# Altium schematic sheet 主板-09099.SCHDOC
size A4
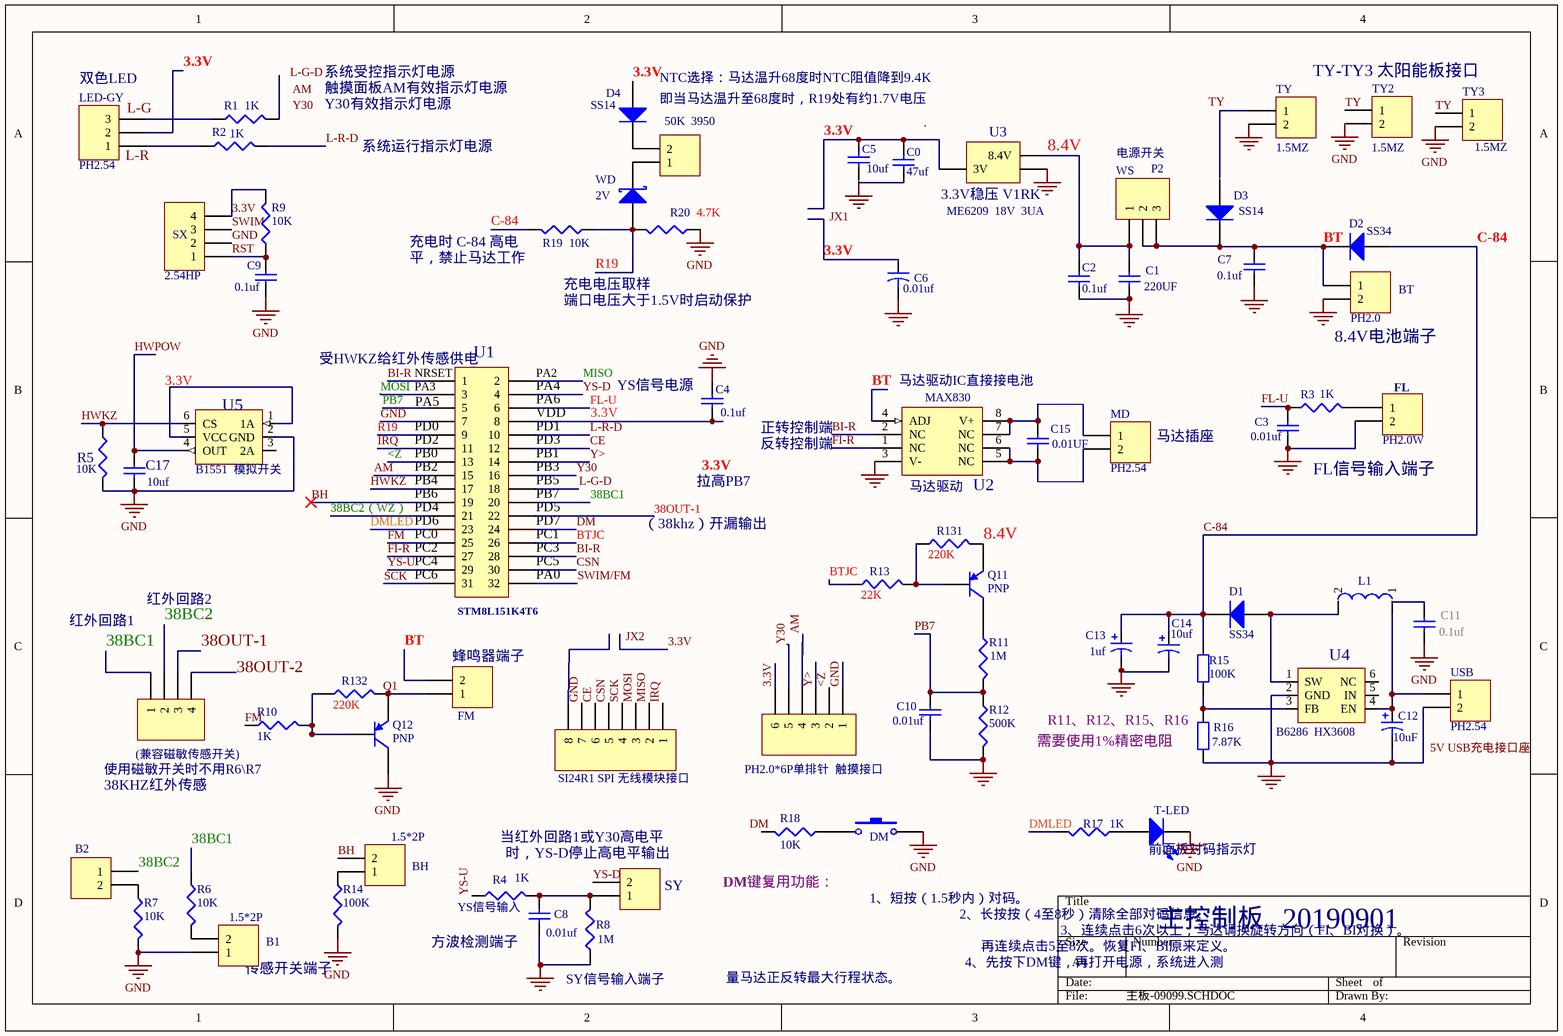
[diagram p0: 主板-09099.SCHDOC]

## Parts
50K_3950  (no value)  [HDR1X2]
(兼容磁敏传感开关)  PH2.0  [HDR1X4]  (value not drawn)
B1  1.5*2P  [HDR1X2]
B2  1.5*2P  [HDR1X2]  (value not drawn)
BH  1.5*2P  [HDR1X2]
BT  PH2.0  [HDR1X2]
C0  value 47uf  [CC1608-0603]
C1  value 220UF  [CC3216-1206]  (hidden comment: Cap Semi)
C2  value 0.1uf  [CC1608-0603]  (hidden comment: Cap Semi)
C3  0.01uf  [CC1608-0603]
C4  value 0.1uf  [CC1608-0603]
C5  10uf  [CC1608-0603]
C6  0.01uf  [CAPPR2-5x6.8]
C7  0.1uf  [CC1608-0603]
C8  0.01uf  [CC1608-0603]
C9  value 0.1uf  [CC1608-0603]  (hidden comment: Cap Semi)
C10  0.01uf  [CC1608-0603]
C11  value 0.1uf  [CC3216-1206]  (hidden comment: Cap Semi)
C12  value 10uF  [C0805]  (hidden comment: Cap Pol1)
C13  value 1uf  [CC3216-1206]
C14  value 10uf  [CC3216-1206]
C15  0.01UF  [CC1608-0603]
C17  10uf  [CC1608-0603]
D1  SS34  [D0805]
D2  SS34  [D0805]
D3  SS14  [DIO7.1-3.9x1.9]
D4  SS14  [DIO7.1-3.9x1.9]
DM  (no value)  [SPST-2]
FL  PH2.0W  [HDR1X2]
FM  (no value)  [HDR1X2]
L1  (no value)  [L7]
LED-GY  PH2.54  [HDR1X3]
MD  PH2.54  [HDR1X2]
PH2.0*6P单排针_触摸接口  Header 6  [HDR1X6]  (value not drawn)
Q11  PNP  [SOT-23B]
Q12  PNP  [SOT-23B]
R1  value 1K  [C1608-0603]
R2  value 1K  [C1608-0603]
R3  value 1K  [C1608-0603]
R4  value 1K  [C1608-0603]
R5  value 10K  [C1608-0603]
R6  value 10K  [C1608-0603]
R7  value 10K  [C1608-0603]
R8  value 1M  [C1608-0603]
R9  value 10K  [C1608-0603]
R10  value 1K  [C1608-0603]
R11  1M  [C1608-0603]
R12  value 500K  [C1608-0603]
R13  22K  [C1608-0603]
R14  value 100K  [C1608-0603]
R15  value 100K  [C0805]  (hidden comment: Res2)
R16  value 7.87K  [C0805]  (hidden comment: Res2)
R17  value 1K  [C1608-0603]
R18  value 10K  [C1608-0603]
R19  10K  [C1608-0603]
R20  4.7K  [C1608-0603]
R131  220K  [C1608-0603]
R132  220K  [C1608-0603]
SI24R1_SPI_无线模块接口  Header 8  [HDR1X8]  (value not drawn)
SX  2.54HP  [HDR1X4]
SY  PH2.0WJ  [HDR1X2]  (value not drawn)
T-LED  (no value)  [LED-1]
TY  1.5MZ  [HDR1X2]
TY2  1.5MZ  [HDR1X2]
TY3  1.5MZ  [HDR1X2]
U1  STM8L151K4T6  [HDR2X16]
U2  马达驱动  Publisher: MAX830  [SO8]
U3  ME6209  18V  3UA  [MHDR2X2]
U4  B6286  HX3608  [2308]
U5  B1551  模拟开关  [2308]
USB  PH2.54  [HDR1X2]
WD  2V  [TO-220AC]
WS  P2  [HDR1X3]

## Nets
GND: B1.1 BT.2 C0.1 C1.2 C2.1 C3.1 C4.2 C6.2 C7.1 C8.1 C9.1 C10.1 C11.2 C12.2 C13.2 C14.2 C17.1 DM.2 FL.2 PH2.0*6P单排针_触摸接口.1 Q12.1(C) R5.1 R7.2 R8.1 R12.1 R14.2 R16.2 R20.1 SI24R1_SPI_无线模块接口.7 SX.2 T-LED.2(K) TY.2 TY2.2 TY3.2 U1.7 U2.3(V-) U3.3.3OUT U4.2(GND) U5.2(GND) USB.2
3.3V: C0.2 C4.1 C5.2 C6.1 D4.1(A) LED-GY.2 PH2.0*6P单排针_触摸接口.6 R9.2 SX.4 U1.8 U3.2(3V)
8.4V: C1.1 C2.2 Q11.3(E) R131.1 U3.3.3_IN(8.4V) WS.1
38BC1: (兼容磁敏传感开关).1 R6.1 U1.20
38BC2: (兼容磁敏传感开关).2 B2.1
38BC2（WZ）: U1.21
38OUT-1: (兼容磁敏传感开关).3 U1.22
<Z: PH2.0*6P单排针_触摸接口.2 U1.13
AM: PH2.0*6P单排针_触摸接口.4 U1.15
BH: BH.2 U1.19
BI-R: U1.1 U1.28 U2.2(NC)  [also labelled NRSET]
BT: BT.1 C7.2 D2.2(K) D3.2(K) FM.2 U2.4(ADJ) WS.2 WS.3
BTJC: R13.2 U1.26
C-84: C13.1 C14.1 D1.2(K) D2.1(A) R15.1 R19.2
CE: SI24R1_SPI_无线模块接口.6 U1.12
CSN: SI24R1_SPI_无线模块接口.5 U1.30
DM: U1.24
DMLED: R17.1 U1.23
FI-R: U1.27 U2.1(NC)
FL-U: C3.2 R3.1 U1.6
FM: R10.1 U1.25
HWKZ: R5.2 U1.17 U5.6(CS)
HWPOW: C17.2 U5.4(OUT)
IRQ: SI24R1_SPI_无线模块接口.1 U1.11
L-G-D: U1.18
L-R-D: R2.2 U1.10
MISO: SI24R1_SPI_无线模块接口.2 U1.2  [also labelled PA2]
MOSI: SI24R1_SPI_无线模块接口.3 U1.3  [also labelled PA3]
PB7: C10.2 R11.1 R12.2 U1.5
R19: R19.1 R20.2 U1.9 WD.3(A)
RST: C9.2 R9.1 SX.1
SCK: SI24R1_SPI_无线模块接口.4 U1.31
SWIM: SX.3
SWIM/FM: U1.32
TY: TY2.1 TY3.1
Y30: PH2.0*6P单排针_触摸接口.5 U1.16
Y>: PH2.0*6P单排针_触摸接口.3 U1.14
YS-D: SY.2 U1.4
YS-U: R4.1 U1.29
Net50K_3950_1: 50K_3950.1 WD.1(K)
Net50K_3950_2: 50K_3950.2 D4.2(K)
NetB1_2: B1.2 R6.2
NetB2_2: B2.2 R7.1
NetBH_1: BH.1 R14.1
NetC8_2: C8.2 R4.2 R8.2 SY.1
NetC12_1: C12.1 L1.1 U4.4(EN) USB.1
NetC15_1: C15.1 MD.2 U2.5(NC) U2.6(NC)
NetC15_2: C15.2 MD.1 U2.7(NC) U2.8(V+)
NetD1_1: D1.1(A) L1.2 U4.1(SW)
NetDM_1: DM.1 R18.2
NetFL_1: FL.1 R3.2
NetFM_1: FM.1 Q12.3(E) R132.1
NetLED-GY_1: LED-GY.1 R2.1
NetLED-GY_3: LED-GY.3 R1.1
NetQ11_1: Q11.1(C) R11.2
NetQ11_2: Q11.2(B) R13.1 R131.2
NetQ12_2: Q12.2(B) R10.2 R132.2
NetR15_2: R15.2 R16.1 U4.3(FB)
NetR17_2: R17.2 T-LED.1(A)
NetU5_1: U5.1(1A) U5.5(VCC)

Not connected (* = marked no-connect by the designer): (兼容磁敏传感开关) 4; C5 1; C11 1; D3 1(A); R1 2; R18 1; SI24R1_SPI_无线模块接口 8; TY 1; U4 5(IN) 6(NC); U5 3(2A)

## Notes on the sheet
- (near LED-GY) 双色LED
- 系统受控指示灯电源
- Y30有效指示灯电源
- 触摸面板AM有效指示灯电源
- (near D4) NTC选择：马达温升68度时NTC阻值降到9.4K
- 即当马达温升至68度时，R19处有约1.7V电压
- TY-TY3 太阳能板接口
- 系统运行指示灯电源
- 电源开关
- (near R19) 充电时 C-84 高电
- (near U3) 3.3V稳压 V1RK
- 平，禁止马达工作
- 充电电压取样
- 端口电压大于1.5V时启动保护
- 受HWKZ给红外传感供电
- (near U2) 马达驱动IC直接接电池
- (near BT) 8.4V电池端子
- (near U1) PD0
- (near U1) PD2
- (near U1) PA5
- (near U1) PA4
- (near U1) PA6
- (near U1) PD1
- (near U1) PD3
- (near U1) VDD
- (near C4) YS信号电源
- (near C4) 正转控制端
- 反转控制端
- (near MD) 马达插座
- (near U1) PD4
- (near U1) PB0
- (near U1) PB2
- (near U1) PB4
- (near U1) PB6
- (near U1) PD5
- (near U1) PB1
- (near U1) PB3
- (near U1) PB5
- (near U1) PB7
- 拉高PB7
- FL信号输入端子
- (near U1) PD6
- (near U1) PC0
- (near U1) PC2
- (near U1) PC4
- (near U1) PC6
- (near U1) PA0
- (near U1) PD7
- (near U1) PC1
- (near U1) PC3
- (near U1) PC5
- （38khz）开漏输出
- 红外回路1
- 红外回路2
- (near FM) 蜂鸣器端子
- 38KHZ红外传感
- 使用磁敏开关时不用R6\R7
- 需要使用1%精密电阻
- R11、R12、R15、R16
- 当红外回路1或Y30高电平
- 时，YS-D停止高电平输出
- 前面板对码指示灯
- (near R4) YS信号输入
- (near R18) DM键复用功能：
- 1、短按（1.5秒内）对码。
- 2、长按按（4至8秒）清除全部对码信息。
- (near B1) 传感开关端子
- 方波检测端子
- (near R8) SY信号输入端子
- 量马达正反转最大行程状态。
- 4、先按下DM键，再打开电源，系统进入测
- 再连续点击5至8次。恢复FI、BI原来定义。
- 3、连续点击6次以上，马达调换旋转方向（FI、BI对换）。
- 主控制板
- 20190901
- Labels drawn without touching a wire or pin: 3.3V, 5V USB充电接口座, 38OUT-2, AM, DM, JX1, JX2, L-G, L-G-D, L-R, Q1, TY, Y30

## Library data of the parts
50K_3950 B1 B2 BH BT FL FM MD SY TY TY2 TY3 USB = Header 2: Header, 2-Pin; LatestRevisionDate: 17-Jul-2002; LatestRevisionNote: Re-released for DXP Platform.; Publisher: Altium Limited
(兼容磁敏传感开关) SX = Header 4: Header, 4-Pin; LatestRevisionDate: 17-Jul-2002; LatestRevisionNote: Re-released for DXP Platform.; Publisher: Altium Limited
C0-C5 C7 C9-C11 C15 C17 = Cap Semi: Capacitor (Semiconductor SIM Model); Published: 8-Jun-2000; LatestRevisionDate: 17-Jul-2002; LatestRevisionNote: Re-released for DXP Platform.; PackageReference: C1206; Publisher: Altium Limited
  C5: Value: 10uf
  C15: Value: 0.01UF
C6 = Cap2: Capacitor; Published: 23-Sep-2002; Publisher: Altium Limited; Value: 0.01uf
C8 = Cap Semi: Capacitor (Semiconductor SIM Model); Value: 100pF; Published: 8-Jun-2000; LatestRevisionDate: 17-Jul-2002; LatestRevisionNote: Re-released for DXP Platform.; PackageReference: C1206; Publisher: Altium Limited
C12-C14 = Cap Pol1: Polarized Capacitor (Radial); Published: 8-Jun-2000; LatestRevisionDate: 17-Jul-2002; LatestRevisionNote: Re-released for DXP Platform.; PackageReference: RB7.6-15; Publisher: Altium Limited; PackageDescription: Polarized Capacitor (Radial); 2 Leads
D1 D2 = Diode: Default Diode; Published: 8-Jun-2000; LatestRevisionDate: 17-Jul-2002; LatestRevisionNote: Re-released for DXP Platform.; PackageVersion: Sep-1996; PackageReference: SMC; Publisher: SS24; PackageDescription: DO-214-AB/SMC; 2 C-Bend Leads; Body 7.9 x 5.9 mm, inc. leads (LxW); Code_JEDEC: DO-214-AB
D3 D4 = Diode 1N914: High Conductance Fast Diode; Published: 8-Jun-2000; LatestRevisionDate: 17-Jul-2002; LatestRevisionNote: Re-released for DXP Platform.; Publisher: Altium Limited; PackageReference: DO-35; DatasheetDocument: 1997; Code_JEDEC: DO-204-AH
DM = SW-PB: Switch; Published: 24-Mar-1999; LatestRevisionDate: 17-Jul-2002; LatestRevisionNote: Re-released for DXP Platform.; Publisher: Altium Limited
L1 = L
LED-GY WS = Header 3: Header, 3-Pin; LatestRevisionDate: 17-Jul-2002; LatestRevisionNote: Re-released for DXP Platform.; Publisher: Altium Limited
PH2.0*6P单排针_触摸接口 = Header 6: Header, 6-Pin; LatestRevisionDate: 17-Jul-2002; LatestRevisionNote: Re-released for DXP Platform.; Publisher: Altium Limited
Q11 Q12 = PNP: PNP Bipolar Transistor; Published: 8-Jun-2000; LatestRevisionDate: 17-Jul-2002; LatestRevisionNote: Re-released for DXP Platform.; PackageReference: SOT-23B; Publisher: Altium Limited; Code_JEDEC: SOT-23
R1-R14 R17-R20 R131 R132 = Res3: Resistor; Published: 8-Jun-2000; LatestRevisionDate: 17-Jul-2002; LatestRevisionNote: Re-released for DXP Platform.; Publisher: Altium Limited
R15 R16 = Res2: Resistor; Published: 8-Jun-2000; LatestRevisionDate: 17-Jul-2002; LatestRevisionNote: Re-released for DXP Platform.; PackageReference: AXIAL-0.4; Publisher: Altium Limited; PackageDescription: Axial Device, Thru-Hole; 2 Leads; 0.4 in Pin Spacing
SI24R1_SPI_无线模块接口 = Header 8: Header, 8-Pin; LatestRevisionDate: 17-Jul-2002; LatestRevisionNote: Re-released for DXP Platform.; Publisher: Altium Limited
T-LED = LED1: Typical RED GaAs LED; Published: 8-Jun-2000; LatestRevisionDate: 17-Jul-2002; LatestRevisionNote: Re-released for DXP Platform.; Publisher: Altium Limited
U1 = Header 16X2: Header, 16-Pin, Dual row; LatestRevisionDate: 17-Jul-2002; LatestRevisionNote: Re-released for DXP Platform.; Publisher: Altium Limited
U2 = LM135D: Precision Temperature Sensor; Published: 24-Aug-2001; LatestRevisionDate: 17-Jul-2002; LatestRevisionNote: Re-released for DXP Platform.; DatasheetDocument: Oct-1997; PackageDocument: Jul-1998; PackageReference: SO8; Code_JEDEC: MS-012-AA; Code_IPC: SO8
U3 = MHDR2X2: Header, 2-Pin, Dual row; LatestRevisionDate: 17-Jul-2002; LatestRevisionNote: Re-released for DXP Platform.; Publisher: Altium Limited
U4 = 1308: 1308A: u4
U5 = 1308
WD = Diode 18TQ045: Schottky Rectifier; Note: Terminal 2 is the TAB and is electrically connected to the cathode; Published: 8-Jun-2000; LatestRevisionDate: 17-Jul-2002; LatestRevisionNote: Re-released for DXP Platform.; Publisher: Altium Limited; PackageReference: TO-220AC; DatasheetVersion: Dec-1997; PackageVersion: Feb-1998; PackageDescription: TO, Thru-Hole, Vertical, Heatsink Mounted; 3 In-Line Leads (1 Absent); Pitch 2.54 mm; ComponentLink1Description: Manufacturer Link; ComponentLink1URL: http://www.irf.com/; ComponentLink2Description: Datasheet; ComponentLink2URL: http://www.irf.com/product-info/datasheets/data/18tq.pdf